# Altium schematic sheet FIT_FPGA_D-E-F.SchDoc
size A4; SheetNumber: 26; SheetTotal: 29
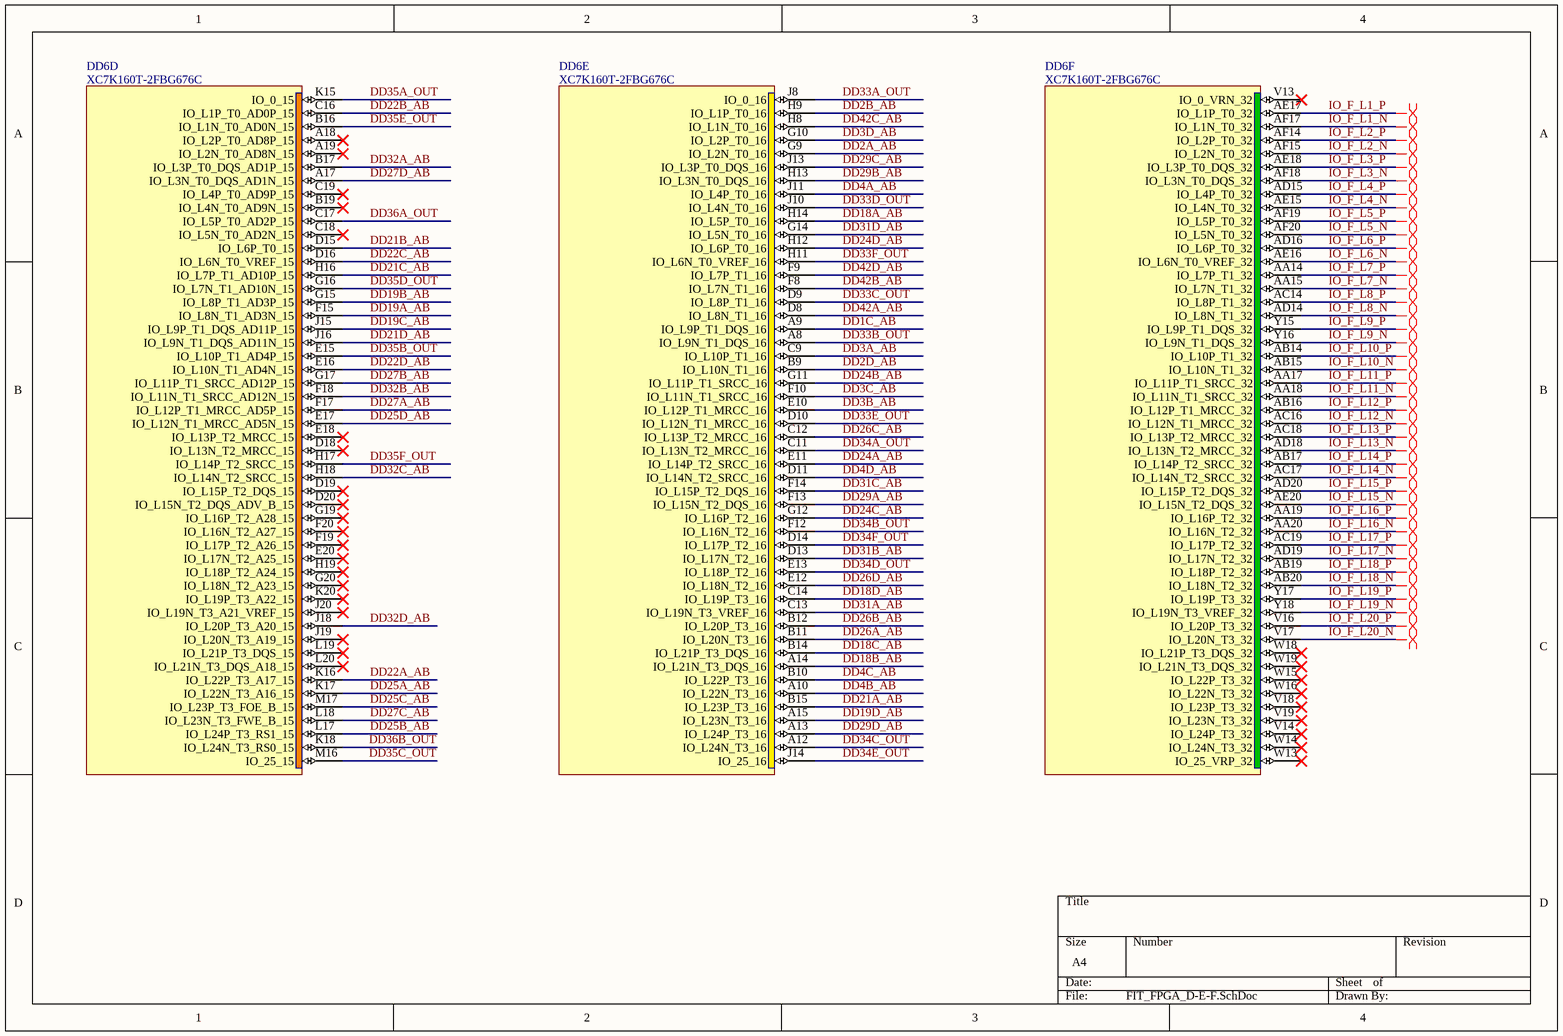
[diagram p0: FIT_FPGA_D-E-F.SchDoc]

## Parts
DD6  XC7K160T-2FBG676C  [BGA676C100P26X26_2700X2700X254]  (parts D,E,F of 15)

## Nets
DD1C_AB: DD6.A9(IO_L9P_T1_DQS_16)
DD2A_AB: DD6.G9(IO_L2N_T0_16)
DD2B_AB: DD6.H9(IO_L1P_T0_16)
DD2D_AB: DD6.B9(IO_L10N_T1_16)
DD3A_AB: DD6.C9(IO_L10P_T1_16)
DD3B_AB: DD6.E10(IO_L12P_T1_MRCC_16)
DD3C_AB: DD6.F10(IO_L11N_T1_SRCC_16)
DD3D_AB: DD6.G10(IO_L2P_T0_16)
DD4A_AB: DD6.J11(IO_L4P_T0_16)
DD4B_AB: DD6.A10(IO_L22N_T3_16)
DD4C_AB: DD6.B10(IO_L22P_T3_16)
DD4D_AB: DD6.D11(IO_L14N_T2_SRCC_16)
DD18A_AB: DD6.H14(IO_L5P_T0_16)
DD18B_AB: DD6.A14(IO_L21N_T3_DQS_16)
DD18C_AB: DD6.B14(IO_L21P_T3_DQS_16)
DD18D_AB: DD6.C14(IO_L19P_T3_16)
DD19A_AB: DD6.F15(IO_L8N_T1_AD3N_15)
DD19B_AB: DD6.G15(IO_L8P_T1_AD3P_15)
DD19C_AB: DD6.J15(IO_L9P_T1_DQS_AD11P_15)
DD19D_AB: DD6.A15(IO_L23N_T3_16)
DD21A_AB: DD6.B15(IO_L23P_T3_16)
DD21B_AB: DD6.D15(IO_L6P_T0_15)
DD21C_AB: DD6.H16(IO_L7P_T1_AD10P_15)
DD21D_AB: DD6.J16(IO_L9N_T1_DQS_AD11N_15)
DD22A_AB: DD6.K16(IO_L22P_T3_A17_15)
DD22B_AB: DD6.C16(IO_L1P_T0_AD0P_15)
DD22C_AB: DD6.D16(IO_L6N_T0_VREF_15)
DD22D_AB: DD6.E16(IO_L10N_T1_AD4N_15)
DD24A_AB: DD6.E11(IO_L14P_T2_SRCC_16)
DD24B_AB: DD6.G11(IO_L11P_T1_SRCC_16)
DD24C_AB: DD6.G12(IO_L16P_T2_16)
DD24D_AB: DD6.H12(IO_L6P_T0_16)
DD25A_AB: DD6.K17(IO_L22N_T3_A16_15)
DD25B_AB: DD6.L17(IO_L24P_T3_RS1_15)
DD25C_AB: DD6.M17(IO_L23P_T3_FOE_B_15)
DD25D_AB: DD6.E17(IO_L12N_T1_MRCC_AD5N_15)
DD26A_AB: DD6.B11(IO_L20N_T3_16)
DD26B_AB: DD6.B12(IO_L20P_T3_16)
DD26C_AB: DD6.C12(IO_L13P_T2_MRCC_16)
DD26D_AB: DD6.E12(IO_L18N_T2_16)
DD27A_AB: DD6.F17(IO_L12P_T1_MRCC_AD5P_15)
DD27B_AB: DD6.G17(IO_L11P_T1_SRCC_AD12P_15)
DD27C_AB: DD6.L18(IO_L23N_T3_FWE_B_15)
DD27D_AB: DD6.A17(IO_L3N_T0_DQS_AD1N_15)
DD29A_AB: DD6.F13(IO_L15N_T2_DQS_16)
DD29B_AB: DD6.H13(IO_L3N_T0_DQS_16)
DD29C_AB: DD6.J13(IO_L3P_T0_DQS_16)
DD29D_AB: DD6.A13(IO_L24P_T3_16)
DD31A_AB: DD6.C13(IO_L19N_T3_VREF_16)
DD31B_AB: DD6.D13(IO_L17N_T2_16)
DD31C_AB: DD6.F14(IO_L15P_T2_DQS_16)
DD31D_AB: DD6.G14(IO_L5N_T0_16)
DD32A_AB: DD6.B17(IO_L3P_T0_DQS_AD1P_15)
DD32B_AB: DD6.F18(IO_L11N_T1_SRCC_AD12N_15)
DD32C_AB: DD6.H18(IO_L14N_T2_SRCC_15)
DD32D_AB: DD6.J18(IO_L20P_T3_A20_15)
DD33A_OUT: DD6.J8(IO_0_16)
DD33B_OUT: DD6.A8(IO_L9N_T1_DQS_16)
DD33C_OUT: DD6.D9(IO_L8P_T1_16)
DD33D_OUT: DD6.J10(IO_L4N_T0_16)
DD33E_OUT: DD6.D10(IO_L12N_T1_MRCC_16)
DD33F_OUT: DD6.H11(IO_L6N_T0_VREF_16)
DD34A_OUT: DD6.C11(IO_L13N_T2_MRCC_16)
DD34B_OUT: DD6.F12(IO_L16N_T2_16)
DD34C_OUT: DD6.A12(IO_L24N_T3_16)
DD34D_OUT: DD6.E13(IO_L18P_T2_16)
DD34E_OUT: DD6.J14(IO_25_16)
DD34F_OUT: DD6.D14(IO_L17P_T2_16)
DD35A_OUT: DD6.K15(IO_0_15)
DD35B_OUT: DD6.E15(IO_L10P_T1_AD4P_15)
DD35C_OUT: DD6.M16(IO_25_15)
DD35D_OUT: DD6.G16(IO_L7N_T1_AD10N_15)
DD35E_OUT: DD6.B16(IO_L1N_T0_AD0N_15)
DD35F_OUT: DD6.H17(IO_L14P_T2_SRCC_15)
DD36A_OUT: DD6.C17(IO_L5P_T0_AD2P_15)
DD36B_OUT: DD6.K18(IO_L24N_T3_RS0_15)
DD42A_AB: DD6.D8(IO_L8N_T1_16)
DD42B_AB: DD6.F8(IO_L7N_T1_16)
DD42C_AB: DD6.H8(IO_L1N_T0_16)
DD42D_AB: DD6.F9(IO_L7P_T1_16)
IO_F_L1_N: DD6.AF17(IO_L1N_T0_32)
IO_F_L1_P: DD6.AE17(IO_L1P_T0_32)
IO_F_L2_N: DD6.AF15(IO_L2N_T0_32)
IO_F_L2_P: DD6.AF14(IO_L2P_T0_32)
IO_F_L3_N: DD6.AF18(IO_L3N_T0_DQS_32)
IO_F_L3_P: DD6.AE18(IO_L3P_T0_DQS_32)
IO_F_L4_N: DD6.AE15(IO_L4N_T0_32)
IO_F_L4_P: DD6.AD15(IO_L4P_T0_32)
IO_F_L5_N: DD6.AF20(IO_L5N_T0_32)
IO_F_L5_P: DD6.AF19(IO_L5P_T0_32)
IO_F_L6_N: DD6.AE16(IO_L6N_T0_VREF_32)
IO_F_L6_P: DD6.AD16(IO_L6P_T0_32)
IO_F_L7_N: DD6.AA15(IO_L7N_T1_32)
IO_F_L7_P: DD6.AA14(IO_L7P_T1_32)
IO_F_L8_N: DD6.AD14(IO_L8N_T1_32)
IO_F_L8_P: DD6.AC14(IO_L8P_T1_32)
IO_F_L9_N: DD6.Y16(IO_L9N_T1_DQS_32)
IO_F_L9_P: DD6.Y15(IO_L9P_T1_DQS_32)
IO_F_L10_N: DD6.AB15(IO_L10N_T1_32)
IO_F_L10_P: DD6.AB14(IO_L10P_T1_32)
IO_F_L11_N: DD6.AA18(IO_L11N_T1_SRCC_32)
IO_F_L11_P: DD6.AA17(IO_L11P_T1_SRCC_32)
IO_F_L12_N: DD6.AC16(IO_L12N_T1_MRCC_32)
IO_F_L12_P: DD6.AB16(IO_L12P_T1_MRCC_32)
IO_F_L13_N: DD6.AD18(IO_L13N_T2_MRCC_32)
IO_F_L13_P: DD6.AC18(IO_L13P_T2_MRCC_32)
IO_F_L14_N: DD6.AC17(IO_L14N_T2_SRCC_32)
IO_F_L14_P: DD6.AB17(IO_L14P_T2_SRCC_32)
IO_F_L15_N: DD6.AE20(IO_L15N_T2_DQS_32)
IO_F_L15_P: DD6.AD20(IO_L15P_T2_DQS_32)
IO_F_L16_N: DD6.AA20(IO_L16N_T2_32)
IO_F_L16_P: DD6.AA19(IO_L16P_T2_32)
IO_F_L17_N: DD6.AD19(IO_L17N_T2_32)
IO_F_L17_P: DD6.AC19(IO_L17P_T2_32)
IO_F_L18_N: DD6.AB20(IO_L18N_T2_32)
IO_F_L18_P: DD6.AB19(IO_L18P_T2_32)
IO_F_L19_N: DD6.Y18(IO_L19N_T3_VREF_32)
IO_F_L19_P: DD6.Y17(IO_L19P_T3_32)
IO_F_L20_N: DD6.V17(IO_L20N_T3_32)
IO_F_L20_P: DD6.V16(IO_L20P_T3_32)

Not connected (* = marked no-connect by the designer): DD6 A18(IO_L2P_T0_AD8P_15)* A19(IO_L2N_T0_AD8N_15)* B19(IO_L4N_T0_AD9N_15)* C18(IO_L5N_T0_AD2N_15)* C19(IO_L4P_T0_AD9P_15)* D18(IO_L13N_T2_MRCC_15)* D19(IO_L15P_T2_DQS_15)* D20(IO_L15N_T2_DQS_ADV_B_15)* E18(IO_L13P_T2_MRCC_15)* E20(IO_L17N_T2_A25_15)* F19(IO_L17P_T2_A26_15)* F20(IO_L16N_T2_A27_15)* G19(IO_L16P_T2_A28_15)* G20(IO_L18N_T2_A23_15)* H19(IO_L18P_T2_A24_15)* J19(IO_L20N_T3_A19_15)* J20(IO_L19N_T3_A21_VREF_15)* K20(IO_L19P_T3_A22_15)* L19(IO_L21P_T3_DQS_15)* L20(IO_L21N_T3_DQS_A18_15)* V13(IO_0_VRN_32)* V14(IO_L24P_T3_32)* V18(IO_L23P_T3_32)* V19(IO_L23N_T3_32)* W13(IO_25_VRP_32)* W14(IO_L24N_T3_32)* W15(IO_L22P_T3_32)* W16(IO_L22N_T3_32)* W18(IO_L21P_T3_DQS_32)* W19(IO_L21N_T3_DQS_32)*

## Layout directives
differential pair: IO_F_L1_N, IO_F_L1_P, IO_F_L2_N, IO_F_L2_P, IO_F_L3_N, IO_F_L3_P, IO_F_L4_N, IO_F_L4_P, IO_F_L5_N, IO_F_L5_P, IO_F_L6_N, IO_F_L6_P, IO_F_L7_N, IO_F_L7_P, IO_F_L8_N, IO_F_L8_P, IO_F_L9_N, IO_F_L9_P, IO_F_L10_N, IO_F_L10_P, IO_F_L11_N, IO_F_L11_P, IO_F_L12_N, IO_F_L12_P, IO_F_L13_N, IO_F_L13_P, IO_F_L14_N, IO_F_L14_P, IO_F_L15_N, IO_F_L15_P, IO_F_L16_N, IO_F_L16_P, IO_F_L17_N, IO_F_L17_P, IO_F_L18_N, IO_F_L18_P, IO_F_L19_N, IO_F_L19_P, IO_F_L20_N, IO_F_L20_P

## Library data of the parts
DD6 = XC7K160T-2FBG676C: KINTEX-7, FPGA, 676-Ball BGA, Pb-Free; Part Description: KINTEX-7 FPGA, 162240 Logic Cells, 400 User I/O, 8 GTXs, 676-Ball BGA, Speed Grade 2, Commercial Grade, Pb-Free; Manufacturer: XILINX; PressFit: No; Bonding: No; Part Number: XC7K160T-2FBG676C; Component Kind: Standard; Component Type: Standard; Device: XC7K160T-2FBG676C; PackageDescription: BGA, 1.00mm Pitch, Square; 676 Pin, 26 Columns X 26 Rows, Body 27.0mm X 27.0mm X 2.54mm H, IPC Medium Density; Manufacturer Part Number: XC7K160T-2FBG676C; Pin Count: 676; Case: BGA676; Mounted: Yes; Socket: No; SMD: Yes; Sense: No; ComponentHeight: 2.54mm; HelpURL: \\cern.ch\dfs\Applications\Altium\Datasheets\XC7K160T-xFBG676C.pdf; ComponentLink1URL: \\cern.ch\dfs\Applications\Altium\Datasheets\XC7K160T-xFBG676C_Package-Pinout.pdf; ComponentLink1Description: Package/Pinout; Author: CERN DEM BC; CreateDate: 06.02.2020; LatestRevisionDate: 06.02.2020